# Altium schematic sheet quectel mc60 breakout.SchDoc
size A3; SheetNumber: 1; SheetTotal: 1
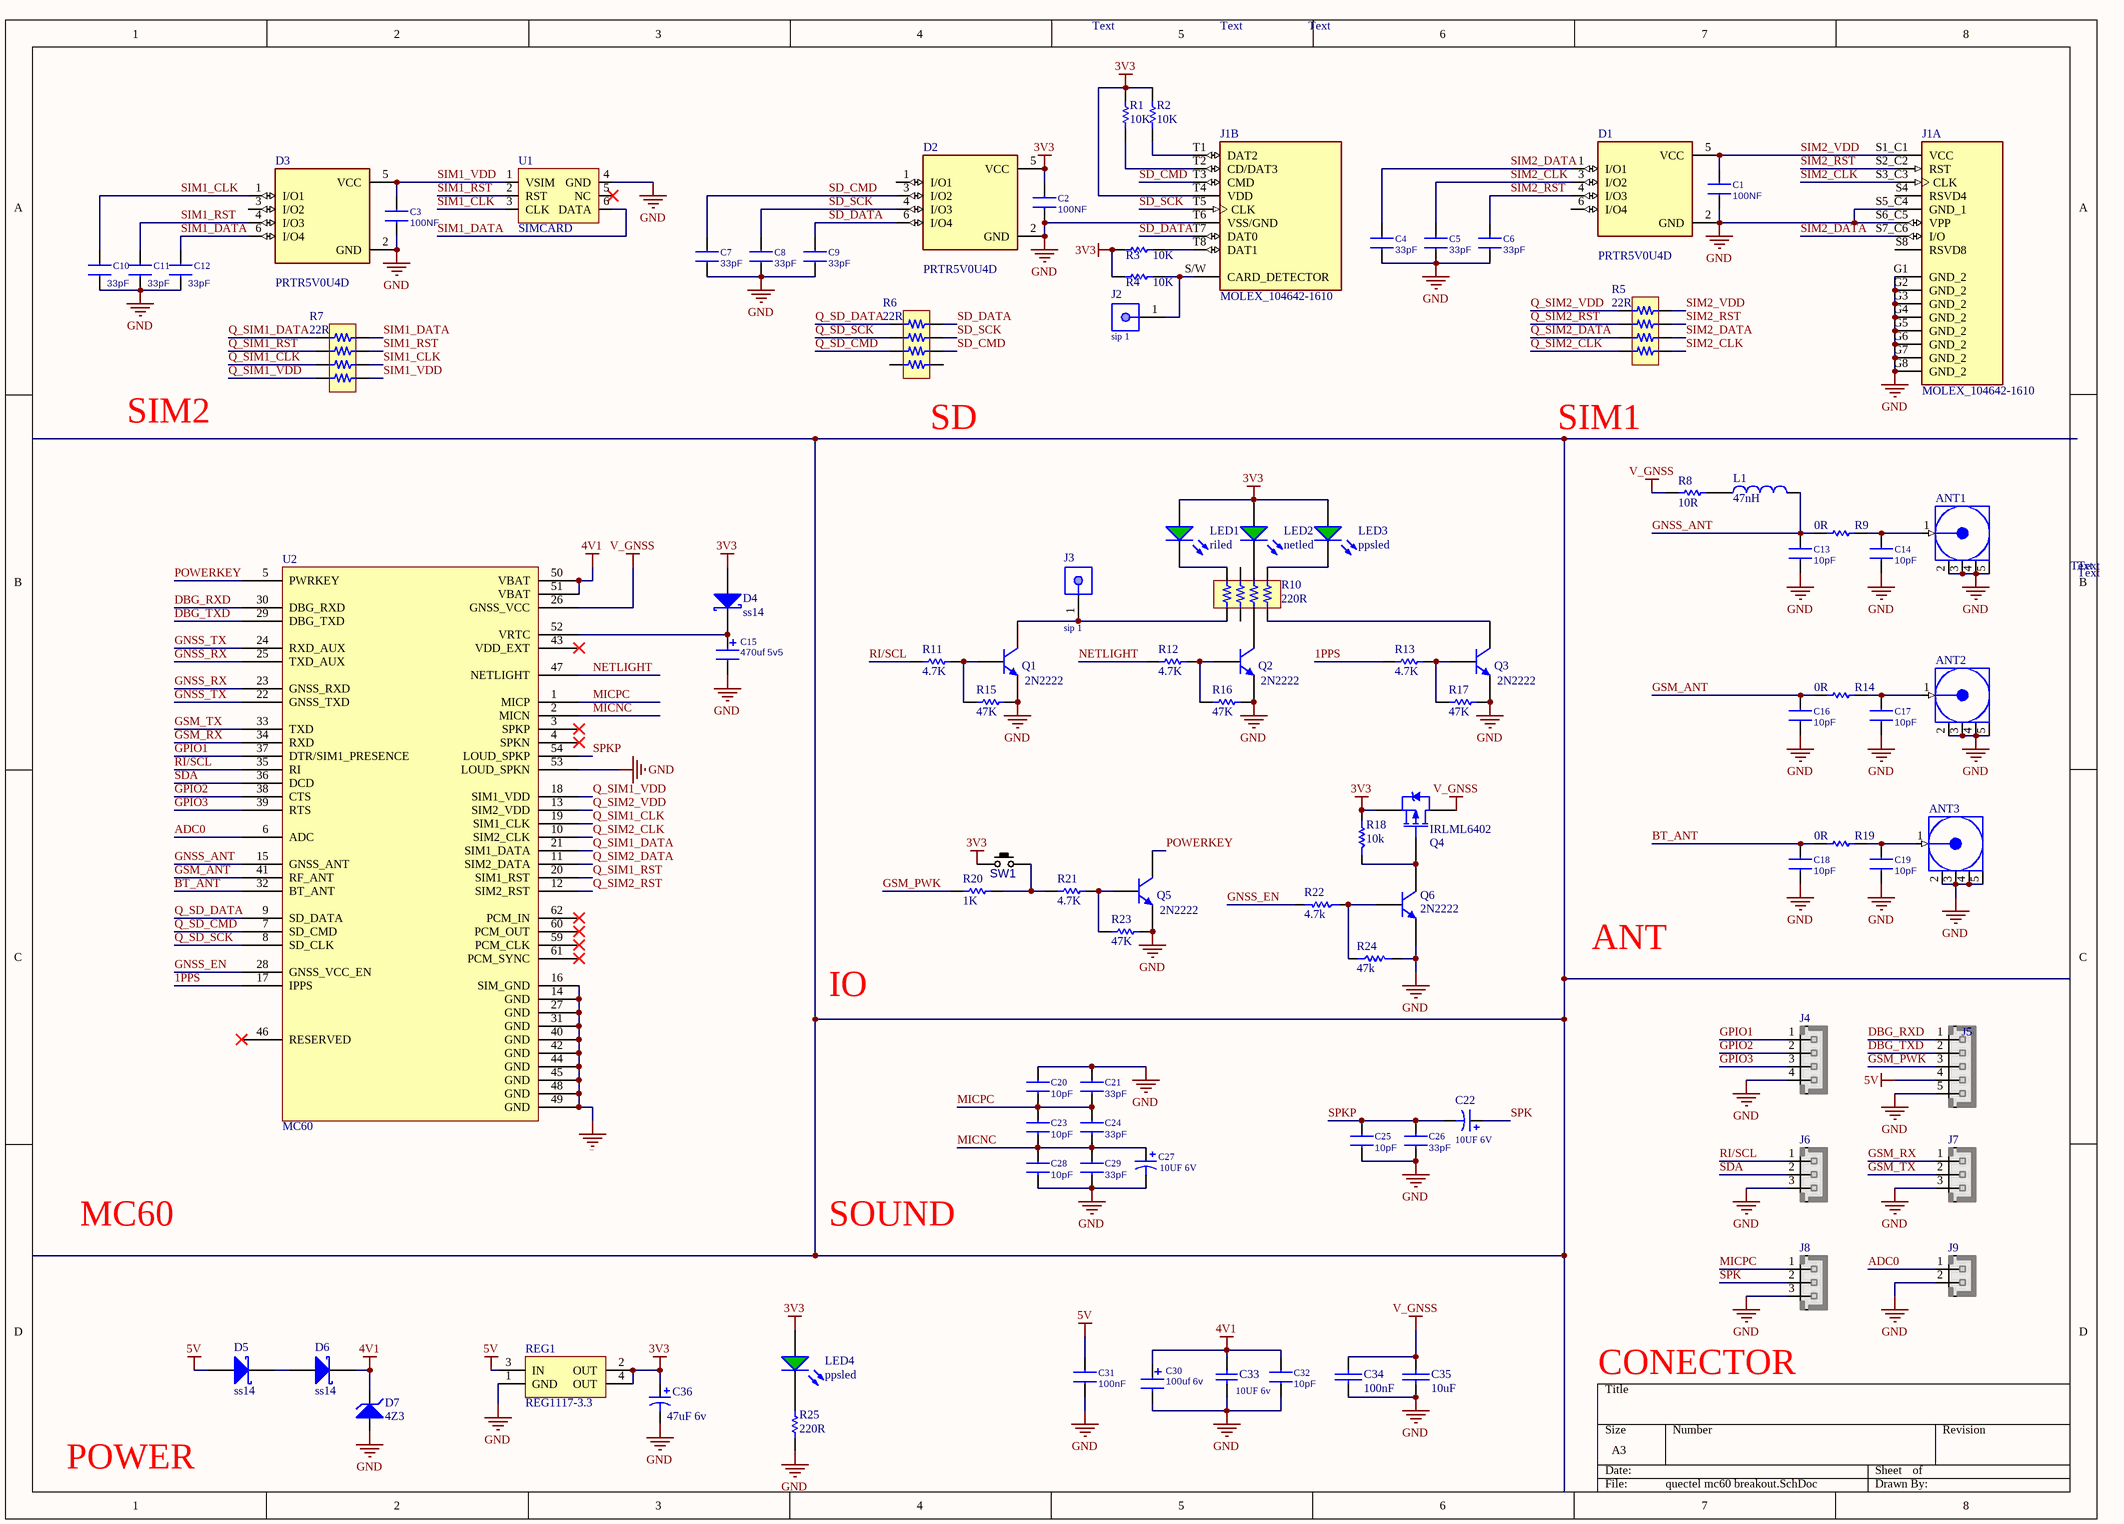
[diagram p0: quectel mc60 breakout.SchDoc]

## Parts
ANT1  WR-SMA PCB Plug  [SMA-RA-6]  (value not drawn)
ANT2  WR-SMA PCB Plug  [SMA-RA-6]  (value not drawn)
ANT3  WR-SMA PCB Plug  [SMA-RA-6]  (value not drawn)
C1  100NF  [C0805E]
C2  100NF  [C0805E]
C3  100NF  [C0805E]
C4  33pF  [C0805E]
C5  33pF  [C0805E]
C6  33pF  [C0805E]
C7  33pF  [C0805E]
C8  33pF  [C0805E]
C9  33pF  [C0805E]
C10  33pF  [C0805E]
C11  33pF  [C0805E]
C12  33pF  [C0805E]
C13  10pF  [C0805E]
C14  10pF  [C0805E]
C15  470uf 5v5  [EEC S0HD473V]
C16  10pF  [C0805E]
C17  10pF  [C0805E]
C18  10pF  [C0805E]
C19  10pF  [C0805E]
C20  10pF  [C0805E]
C21  33pF  [C0805E]
C22  10UF 6V  [C_TN_3216 (A)]
C23  10pF  [C0805E]
C24  33pF  [C0805E]
C25  10pF  [C0805E]
C26  33pF  [C0805E]
C27  10UF 6V  [C_TN_3216 (A)]
C28  10pF  [C0805E]
C29  33pF  [C0805E]
C30  100uf 6v  [C_TN_7343 (D)]
C31  100nF  [C0805E]
C32  10pF  [C0805E]
C33  10UF 6v  [C_TN_3216 (A)]
C34  100nF  [C0805E]
C35  10uF  [C_TN_3216 (A)]
C36  47uF 6v  [C_TN_3528 (B)]
D1  PRTR5V0U4D  [PRTR5V0U4D]
D2  PRTR5V0U4D  [PRTR5V0U4D]
D3  PRTR5V0U4D  [PRTR5V0U4D]
D4  ss14  [SMA]
D5  ss14  [SMA]
D6  ss14  [SMA]
D7  4Z3  [SOD80]
J1  MOLEX_104642-1610  [MOLEX_104642-1610]  (parts A,B of 2)
J2  sip 1  [1_SIP]
J3  sip 1  [1_SIP]
J4  HHDR_4  [XH_4]  (value not drawn)
J5  XH_5  [XH_5]  (value not drawn)
J6  HHDR_3  [XH_3]  (value not drawn)
J7  HHDR_3  [XH_3]  (value not drawn)
J8  HHDR_3  [XH_3]  (value not drawn)
J9  HHDR_2  [XH_2]  (value not drawn)
L1  value 47nH  [L0805E]
LED1  riled  [LED1206RED]
LED2  netled  [LED1206RED]
LED3  ppsled  [LED1206RED]
LED4  ppsled  [LED1206RED]
Q1  2N2222  [SOT-23A]
Q2  2N2222  [SOT-23A]
Q3  2N2222  [SOT-23A]
Q4  IRLML6402  [SOT-23A]
Q5  2N2222  [SOT-23A]
Q6  2N2222  [SOT-23A]
R1  10K  [R0805E]
R2  10K  [R0805E]
R3  10K  [R0805E]
R4  10K  [R0805E]
R5  22R  [RESNET 1206-8]
R6  22R  [RESNET 1206-8]
R7  22R  [RESNET 1206-8]
R8  10R  [R0805E]
R9  0R  [R0805E]
R10  220R  [RESNET 1206-8]
R11  4.7K  [R0805E]
R12  4.7K  [R0805E]
R13  4.7K  [R0805E]
R14  0R  [R0805E]
R15  47K  [R0805E]
R16  47K  [R0805E]
R17  47K  [R0805E]
R18  10k  [R0805E]
R19  0R  [R0805E]
R20  1K  [R0805E]
R21  4.7K  [R0805E]
R22  4.7k  [R0805E]
R23  47K  [R0805E]
R24  47k  [R0805E]
R25  220R  [R0805E]
REG1  REG1117-3.3  [SOT223_L]
SW1  PUSHBUTTON  [SWPBS_SPST_6X3X5]  (value not drawn)
U1  SIMCARD  [DESIRE 626]
U2  MC60  [MC60]

## Nets
3V3: C2.1 C36.1 D2.5(VCC) D4.1(A) J1.T4(VDD) LED1.1(A) LED2.1(A) LED3.1(A) LED4.1(A) Q4.2(S) R1.2 R2.2 R3.2 R4.2 R18.2 REG1.2(OUT) REG1.4(OUT) SW1.1(P1)
4V1: C30.1 C32.2 C33.1 D6.2(K) D7.2(K) U2.50(VBAT) U2.51(VBAT)
5V: C31.2 D5.1(A) J5.4 REG1.3(IN)
GND: ANT1.2(GND) ANT1.3(GND) ANT1.4(GND) ANT1.5(GND) ANT2.2(GND) ANT2.3(GND) ANT2.4(GND) ANT2.5(GND) ANT3.2(GND) ANT3.3(GND) ANT3.4(GND) ANT3.5(GND) C1.2 C2.2 C3.2 C4.2 C5.2 C6.2 C7.2 C8.2 C9.2 C10.2 C11.2 C12.2 C13.2 C14.2 C15.2 C16.2 C17.2 C18.2 C19.2 C20.1 C21.1 C25.2 C26.2 C27.2 C28.2 C29.2 C30.2 C31.1 C32.1 C33.2 C34.2(-) C35.2(-) C36.2 D1.2(GND) D2.2(GND) D3.2(GND) D7.1(A) J1.G1(GND_2) J1.G2(GND_2) J1.G3(GND_2) J1.G4(GND_2) J1.G5(GND_2) J1.G6(GND_2) J1.G7(GND_2) J1.G8(GND_2) J1.S5_C4(GND_1) J1.S6_C5(VPP) J1.T6(VSS/GND) J4.4 J5.5 J6.3 J7.3 J8.3 J9.2 Q1.1(E) Q2.1(E) Q3.1(E) Q5.1(E) Q6.2(E) R15.2 R16.2 R17.2 R23.2 R24.2 R25.1 REG1.1(GND) U1.4(GND) U2.14(GND) U2.16(SIM_GND) U2.27(GND) U2.31(GND) U2.40(GND) U2.42(GND) U2.44(GND) U2.45(GND) U2.48(GND) U2.49(GND) U2.53(LOUD_SPKN)
V_GNSS: C34.1(+) C35.1(+) Q4.3(D) R8.2 U2.26(GNSS_VCC)
1PPS: R13.1 U2.17(IPPS)
ADC0: J9.1 U2.6(ADC)
BT_ANT: C18.1 R19.1 U2.32(BT_ANT)
DBG_RXD: J5.1 U2.30(DBG_RXD)
DBG_TXD: J5.2 U2.29(DBG_TXD)
GNSS_ANT: C13.1 L1.2 R9.1 U2.15(GNSS_ANT)
GNSS_EN: R22.2 U2.28(GNSS_VCC_EN)
GNSS_RX: U2.23(GNSS_RXD) U2.25(TXD_AUX)
GNSS_TX: U2.22(GNSS_TXD) U2.24(RXD_AUX)
GPIO1: J4.1 U2.37(DTR/SIM1_PRESENCE)
GPIO2: J4.2 U2.38(CTS)
GPIO3: J4.3 U2.39(RTS)
GSM_ANT: C16.1 R14.1 U2.41(RF_ANT)
GSM_PWK: J5.3 R20.1
GSM_RX: J7.1 U2.34(RXD)
GSM_TX: J7.2 U2.33(TXD)
MICNC: C23.2 C24.2 C27.1 C28.1 C29.1 U2.2(MICN)
MICPC: C20.2 C21.2 C23.1 C24.1 J8.1 U2.1(MICP)
NETLIGHT: R12.1 U2.47(NETLIGHT)
POWERKEY: Q5.3(C) U2.5(PWRKEY)
Q_SD_CMD: R6.3 U2.7(SD_CMD)
Q_SD_DATA: R6.1 U2.9(SD_DATA)
Q_SD_SCK: R6.2 U2.8(SD_CLK)
Q_SIM1_CLK: R7.3 U2.19(SIM1_CLK)
Q_SIM1_DATA: R7.1 U2.21(SIM1_DATA)
Q_SIM1_RST: R7.2 U2.20(SIM1_RST)
Q_SIM1_VDD: R7.4 U2.18(SIM1_VDD)
Q_SIM2_CLK: R5.4 U2.10(SIM2_CLK)
Q_SIM2_DATA: R5.3 U2.11(SIM2_DATA)
Q_SIM2_RST: R5.2 U2.12(SIM2_RST)
Q_SIM2_VDD: R5.1 U2.13(SIM2_VDD)
RI/SCL: J6.1 R11.1 U2.35(RI)
SD_CMD: C7.1 D2.3(I/O2) J1.T3(CMD) R6.6
SD_DATA: C9.1 D2.6(I/O4) J1.T7(DAT0) R6.8
SD_SCK: C8.1 D2.4(I/O3) J1.T5(CLK) R6.7
SDA: J6.2 U2.36(DCD)
SIM1_CLK: C10.1 D3.1(I/O1) R7.6 U1.3(CLK)
SIM1_DATA: C12.1 D3.6(I/O4) R7.8 U1.6(DATA)
SIM1_RST: C11.1 D3.4(I/O3) R7.7 U1.2(RST)
SIM1_VDD: C3.1 D3.5(VCC) R7.5 U1.1(VSIM)
SIM2_CLK: C5.1 D1.3(I/O2) J1.S3_C3(CLK) R5.5
SIM2_DATA: C4.1 D1.1(I/O1) J1.S7_C6(I/O) R5.6
SIM2_RST: C6.1 D1.4(I/O3) J1.S2_C2(RST) R5.7
SIM2_VDD: C1.1 D1.5(VCC) J1.S1_C1(VCC) R5.8
SPK: C22.1 J8.2
SPKP: C22.2 C25.1 C26.1 U2.54(LOUD_SPKP)
NetANT1_1: ANT1.1(Signal) C14.1 R9.2
NetANT2_1: ANT2.1(Signal) C17.1 R14.2
NetANT3_1: ANT3.1(Signal) C19.1 R19.2
NetC15_1: C15.1 D4.2(K) U2.52(VRTC)
NetD5_2: D5.2(K) D6.1(A)
NetJ1_S/W: J1.S/W(CARD_DETECTOR) J2.1 R4.1
NetJ1_T1: J1.T1(DAT2) R2.1
NetJ1_T2: J1.T2(CD/DAT3) R1.1
NetJ1_T8: J1.T8(DAT1) R3.1
NetJ3_1: J3.1 Q1.3(C) R10.5
NetL1_1: L1.1 R8.1
NetLED1_2: LED1.2(K) R10.4
NetLED2_2: LED2.2(K) R10.2
NetLED3_2: LED3.2(K) R10.1
NetLED4_2: LED4.2(K) R25.2
NetQ1_2: Q1.2(B) R11.2 R15.1
NetQ2_2: Q2.2(B) R12.2 R16.1
NetQ2_3: Q2.3(C) R10.7
NetQ3_2: Q3.2(B) R13.2 R17.1
NetQ3_3: Q3.3(C) R10.8
NetQ4_1: Q4.1(G) Q6.3(C) R18.1
NetQ5_2: Q5.2(B) R21.2 R23.1
NetQ6_1: Q6.1(B) R22.1 R24.1
NetR20_2: R20.2 R21.1 SW1.2(P3)

Not connected (* = marked no-connect by the designer): D1 6(I/O4); D2 1(I/O1); D3 3(I/O2); J1 S4(RSVD4) S8(RSVD8); R6 4 5; R10 3 6; U1 5(NC)*; U2 3(SPKP)* 4(SPKN)* 43(VDD_EXT)* 46(RESERVED)* 59(PCM_CLK)* 60(PCM_OUT)* 61(PCM_SYNC)* 62(PCM_IN)*

## Notes on the sheet
- Text
- SIM2
- (near R6) SD
- SIM1
- IO
- ANT
- MC60
- SOUND
- CONECTOR
- POWER

## Library data of the parts
ANT1-ANT3 = WR-SMA PCB Plug: WR-SMA PCB Plug, THT, Right Angle; Part Number: 60313002124523; Impedance: 50Ohm; Connector Type: SMA; Frequency Range: DC~18GHz; Interface: MIL-STD-348; Center Contact Diameter: 1.27mm; ComponentLink1Description: Manufacturer; ComponentLink1URL: http://www.we-online.de; ComponentLink2Description: Datasheet; ComponentLink2URL: https://katalog.we-online.com/em/datasheet/60313002124523.pdf; Published Date: May 2019; Publisher: Wurth Elektronik; Operating Temperature: -65 to +165degC; Gender: Plug; Packaging: Tray; Mounting Technology: THT; Orientation Type: Right Angle
C1-C14 C16-C21 C23-C26 C28 C29 C31 C32 = Cap 1206: Capacitor
C15 C30 = CPM3528: Capacitor
  C15: Value: 470uf 5v5
  C30: Value: 100uf 6v
C22 C27 = CAP ELECTRICAL: CAPASITOR ELECTRICAL DIP SMALL PACKAGE; Value: 4700u 6.3V; Published: 8-Jun-2000; LatestRevisionDate: 17-Jul-2002; LatestRevisionNote: Re-released for DXP Platform.; PackageReference: RB7.6-15; Publisher: Altium Limited; PackageDescription: Polarized Capacitor (Radial); 2 Leads
C33 = Cap: Capacitor; Published: 8-Jun-2000; LatestRevisionDate: 17-Jul-2002; LatestRevisionNote: Re-released for DXP Platform.; PackageReference: RAD-0.3; Publisher: Altium Limited; PackageDescription: Radial Cap, Thru-Hole; 2 Leads; 0.3 in Pin Spacing; Value: 10uF
C34 C35 = Cap-Bipolar: Bipolar Capacitor; Voltage: 100V; Designer: Saeid Jorablo; Organazation: ControTec; Adding Date: 1387/12/20
  C34: Value: 100nF
  C35: Value: 10uF
C36 = Cap Pol1: Polarized Capacitor (Radial); Published: 8-Jun-2000; LatestRevisionDate: 17-Jul-2002; LatestRevisionNote: Re-released for DXP Platform.; PackageReference: RB7.6-15; Publisher: Altium Limited; Value: 47uF 6v
D4-D6 = Schottky: Silicon Schottky Diode for High-Speed Switching; Note: Pin 2 is not connected and not drawn.; Published: 21-Mar-2003; DatasheetDocument: Oct-1999; PackageDocument: Sep-2001; PackageReference: SOT-23; Publisher: Altium Limited; ComponentLink1Description: Manufacturer Link; ComponentLink1URL: http://www.infineon.com/; ComponentLink2Description: Datasheet; ComponentLink2URL: http://www.infineon.com/upload/Document/cmc_upload/documents/009/380/bas40_bas140series.pdf
D7 = D Zener: Zener Diode; Published: 8-Jun-2000; LatestRevisionDate: 17-Jul-2002; LatestRevisionNote: Re-released for DXP Platform.; PackageReference: DIODE-0.7; Publisher: Altium Limited
J1 = MOLEX_104642-1610: 17 (16 + 1) Position Card Connector Combo - microSDâ„¢, Micro SIM Surface Mount, Right Angle Gold or Gold-Palladium; MF: Molex; Package: None; SnapEDA_Link: https://www.snapeda.com/parts/104642-1610/Molex/view-part/501052/?ref=snap; Mouser-Purchase-URL: https://snapeda.com/shop?store=Mouser&id=501052; MP: 104642-1610; Price: None; Availability: Warning; Value: *
J2 J3 = sip 1: WR-PHD Pin Header, THT, pitch 2.54mm, Single Row, Vertical, 1pin; Part Number: 61300111121; Pin Number: 1; Gender: Male; Rated Current: 3A; Working Voltage: 250VAC; Withstanding Voltage: 500VAC; Contact Resistance: 20mOhm; ComponentLink1Description: Manufacturer; ComponentLink1URL: http://www.we-online.de; ComponentLink2Description: Datasheet; ComponentLink2URL: https://katalog.we-online.de/em/datasheet/6130xx11121.pdf; Published Date: June 2019; Publisher: Wurth Elektronik; Pitch: 2.54mm; Operating Temperature: -40 to +105degC; Mounting Technology: THT; Packaging: Bag; Row Number: Single; Orientation: Vertical
J4 = XH_4: JST-XH pitch: 2.5mm; VALUE: HHDR_4
J5 = XH_5: JST-XH pitch: 2.5mm; MANF: JST; MANF_P#: JST-B5B-XHA; VALUE: XH_5
J6-J8 = XH_3: JST-XH pitch: 2.5mm; VALUE: HHDR_3
J9 = XH_2: JST-XH pitch: 2.5mm; VALUE: HHDR_2
L1 = B82462G4102M000: SMT Power Inductor; Size 6.3�6.3�3.0mm, �20% Tolerance, 1uH, 3.4A; PCB_Layout: Complies with manufacturer's recommendation.; Published: 26-Sep-2008; DatasheetVersion: Mar-2008; PackageVersion: Mar-2008; PackageReference: B82462G4; Publisher: Altium Limited; PackageDescription: SM Power Inductor; 2 Leads; Body 6.3 x 6.3 x 3.0 mm (LxWxH); ComponentLink1Description: Manufacturer Link; ComponentLink1URL: http://www.epcos.com/; ComponentLink2Description: Datasheet; ComponentLink2URL: http://www.epcos.com/inf/30/db/ind_2008/b82462g4.pdf
LED1-LED4 = LED3mm
Q1-Q3 = BC547 SMD: NPN 2N2222 SMD TRANSISTOR; Published: 8-Jun-2000; LatestRevisionDate: 15-Jan-2003; LatestRevisionNote: PCB Footprint 'BCY-W3/D4.7' replaced; DatasheetVersion: 1997; PackageVersion: Sep-1998; PackageReference: TO-92A; Publisher: Altium Limited; PackageDescription: TO, Flat Index; 3 In-Line, Axial Leads; Body Dia. 4.5mm; Leads 0.51 x 0.48 mm (max); ComponentLink1Description: Manufacturer Link; ComponentLink1URL: http://www.fairchildsemi.com/; ComponentLink2Description: Datasheet; ComponentLink2URL: http://www.fairchildsemi.com/ds/2N%2F2N3904.pdf
Q4 = IRLML6401: HEXFET Power MOSFET; Published: 17-Sep-2003; DatasheetVersion: 2-Jul-2001; PackageVersion: Jul-2001; PackageReference: Micro3; Publisher: Altium Limited; PackageDescription: 3-Pin SOT-23 Package 0.95 mm Pitch, 2.3 mm Lead Span; ComponentLink1Description: Manufacturer Link; ComponentLink1URL: http://www.irf.com/; ComponentLink2Description: Datasheet; ComponentLink2URL: http://www.irf.com/product-info/datasheets/data/IRLML6401.pdf
Q5 = BC547 SMD: NPN2N2222 SMD TRANSISTOR; Published: 8-Jun-2000; LatestRevisionDate: 15-Jan-2003; LatestRevisionNote: PCB Footprint 'BCY-W3/D4.7' replaced; DatasheetVersion: 1997; PackageVersion: Sep-1998; PackageReference: TO-92A; Publisher: Altium Limited; PackageDescription: TO, Flat Index; 3 In-Line, Axial Leads; Body Dia. 4.5mm; Leads 0.51 x 0.48 mm (max); ComponentLink1Description: Manufacturer Link; ComponentLink1URL: http://www.fairchildsemi.com/; ComponentLink2Description: Datasheet; ComponentLink2URL: http://www.fairchildsemi.com/ds/2N%2F2N3904.pdf
Q6 = PMBT3904: NPN2N2222 SMD TRANSISTOR; Published: 17-Sep-2003; LatestRevisionDate: 12-Dec-2006; LatestRevisionNote: IPC-7351 Footprint Added.; DatasheetVersion: 27-Apr-1999; PackageVersion: May-1999; PackageReference: SOT23; Publisher: Altium Limited; PackageDescription: 3-Pin SOT-23 Package 0.95 mm Pitch, 2.3 mm Lead Span; ComponentLink1Description: Manufacturer Link; ComponentLink1URL: http://www.semiconductors.philips.com/; ComponentLink2Description: Datasheet; ComponentLink2URL: http://www.semiconductors.philips.com/acrobat/datasheets/PMBT3904_4.pdf
R1-R4 R8 R9 R11-R17 R19 R21 R23 R25 = Res1: Resistor; Value: 1K; Published: 8-Jun-2000; Publisher: Altium Limited; LatestRevisionDate: 17-Jul-2002; LatestRevisionNote: Re-released for DXP Platform.; PackageReference: AXIAL-0.3; PackageDescription: Axial Device, Thru-Hole; 2 Leads; 0.3 in Pin Spacing
R5-R7 R10 = Resistor Array 4
R18 R22 R24 = Resistor
  R18: Value: 10k
  R22: Value: 4.7k
  R24: Value: 47k
R20 = Res1: Resistor; Published: 8-Jun-2000; Publisher: Altium Limited; Value: 1K; LatestRevisionDate: 17-Jul-2002; LatestRevisionNote: Re-released for DXP Platform.; PackageReference: AXIAL-0.3; PackageDescription: Axial Device, Thru-Hole; 2 Leads; 0.3 in Pin Spacing
REG1 = REG1117-3.3: 800mA and 1A Low Dropout Positive Regulator 2.85V, 3.3V, 5V, and Adjustable; Published: 8-Jun-2000; LatestRevisionDate: 17-Jul-2002; LatestRevisionNote: Re-released for DXP Platform.; DatasheetVersion: Sep-1997; PackageVersion: revC; PackageReference: ZZ311; Publisher: Altium Limited; PackageDescription: SOT-223/SC-73; 4 Leads; Body 6.7 x 7.3 mm, inc. leads (LxW max); ComponentLink1Description: Manufacturer Link; ComponentLink1URL: http://www.ti.com/; ComponentLink2Description: Datasheet; ComponentLink2URL: http://www-s.ti.com/sc/ds/REG1117.pdf; Supplier Iran: JavanElectronic
SW1 = SWPBS_SPST_6X3X4: SWITCH, PUSH BUTTON, TACTILE, SMD, SPST, 6X3.5X4.3mm; MANF: Panasonic; DESC: DESCRIPTION; MANF_P#: EVQ-PNF04M; VALUE: PUSHBUTTON; ASSEMBLY: ASSEMBLY; PARAM: PARAM; PRICE: PRICE
U1 = SIMCARD 6PIN